# EAGLE design Data Cable REPLACMENT (EAGLE 9.6.2)
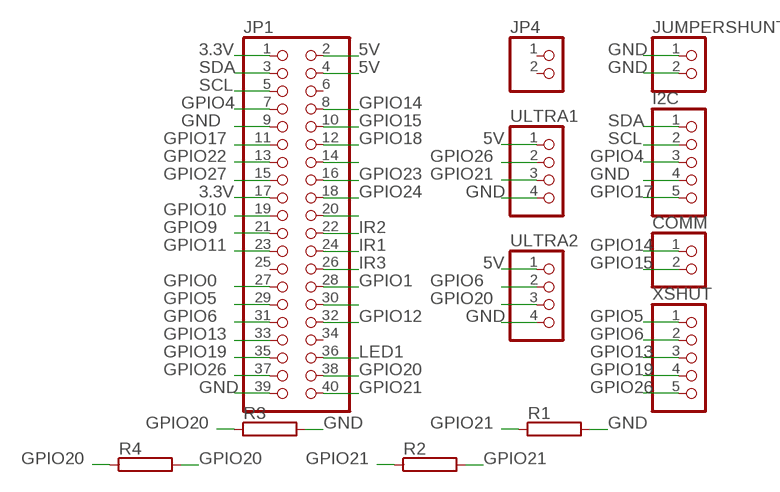
[diagram p0: schematic, sheet 1]

## Parts
COMM  PINHD-1X2  [1X02]
I2C  PINHD-1X5  [1X05]
JP1  PINHD-2X20  [2X20]
JP4  PINHD-1X2  [1X02]
JUMPERSHUNT  PINHD-1X2  [1X02]
R1  RHPS58  [HPS58]
R2  RHPS58  [HPS58]
R3  RHPS58  [HPS58]
R4  RHPS58  [HPS58]
ULTRA1  PINHD-1X4  [1X04]
ULTRA2  PINHD-1X4  [1X04]
XSHUT  PINHD-1X5  [1X05]

## Nets
3.3V: JP1.1 JP1.17
5V: JP1.2 JP1.4 ULTRA1.1 ULTRA2.1
GND: I2C.4 JP1.9 JP1.39 JUMPERSHUNT.1 JUMPERSHUNT.2 R1.2 R3.2 ULTRA1.4 ULTRA2.4
GPIO0: JP1.27
GPIO1: JP1.28
GPIO4: I2C.3 JP1.7
GPIO5: JP1.29 XSHUT.1
GPIO6: JP1.31 ULTRA2.2 XSHUT.2
GPIO9: JP1.21
GPIO10: JP1.19
GPIO11: JP1.23
GPIO12: JP1.32
GPIO13: JP1.33 XSHUT.3
GPIO14: COMM.1 JP1.8
GPIO15: COMM.2 JP1.10
GPIO17: I2C.5 JP1.11
GPIO18: JP1.12
GPIO19: JP1.35 XSHUT.4
GPIO20: JP1.38 R3.1 R4.1 R4.2 ULTRA2.3
GPIO21: JP1.40 R1.1 R2.1 R2.2 ULTRA1.3
GPIO22: JP1.13
GPIO23: JP1.16
GPIO24: JP1.18
GPIO26: JP1.37 ULTRA1.2 XSHUT.5
GPIO27: JP1.15
IR1: JP1.24
IR2: JP1.22
IR3: JP1.26
LED1: JP1.36
N$23: JP1.30
N$28: JP1.20
N$31: JP1.14
SCL: I2C.2 JP1.5
SDA: I2C.1 JP1.3
Unconnected: JP1.6 JP1.25 JP1.34 JP4.1 JP4.2

## Library data of the parts
COMM JP4 JUMPERSHUNT = pinhead:PINHD-1X2: PIN HEADER
I2C XSHUT = pinhead:PINHD-1X5: PIN HEADER
JP1 = pinhead by eyad and omar:PINHD-2X20: PIN HEADER
R1-R4 = resistor-power:R: Power Resitor; OC_FARNELL: unknown; OC_NEWARK: unknown
ULTRA1 ULTRA2 = pinhead:PINHD-1X4: PIN HEADER

## Board
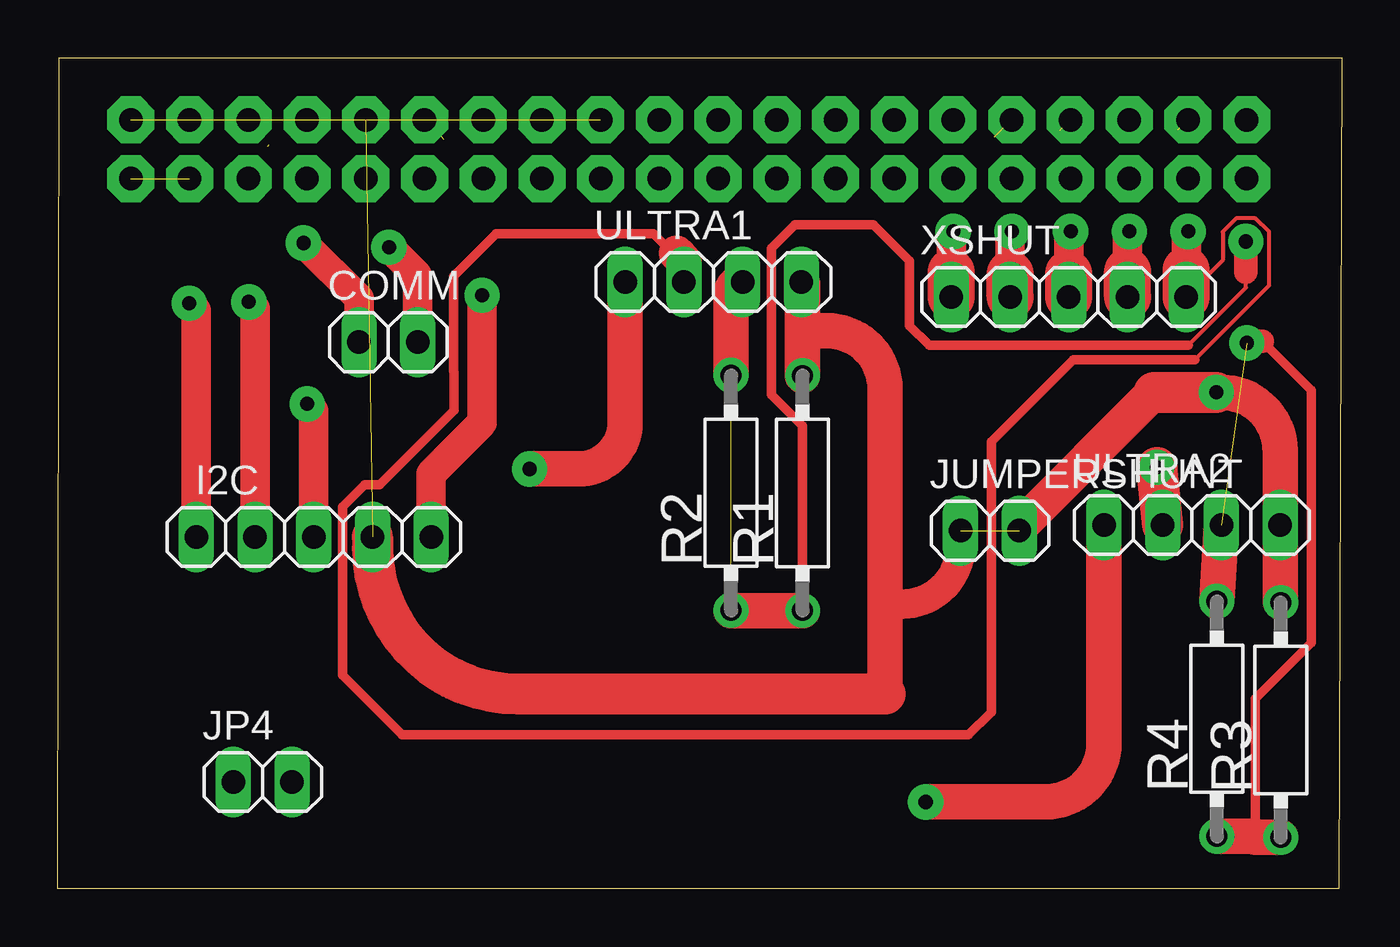
[diagram p1: board, top side]
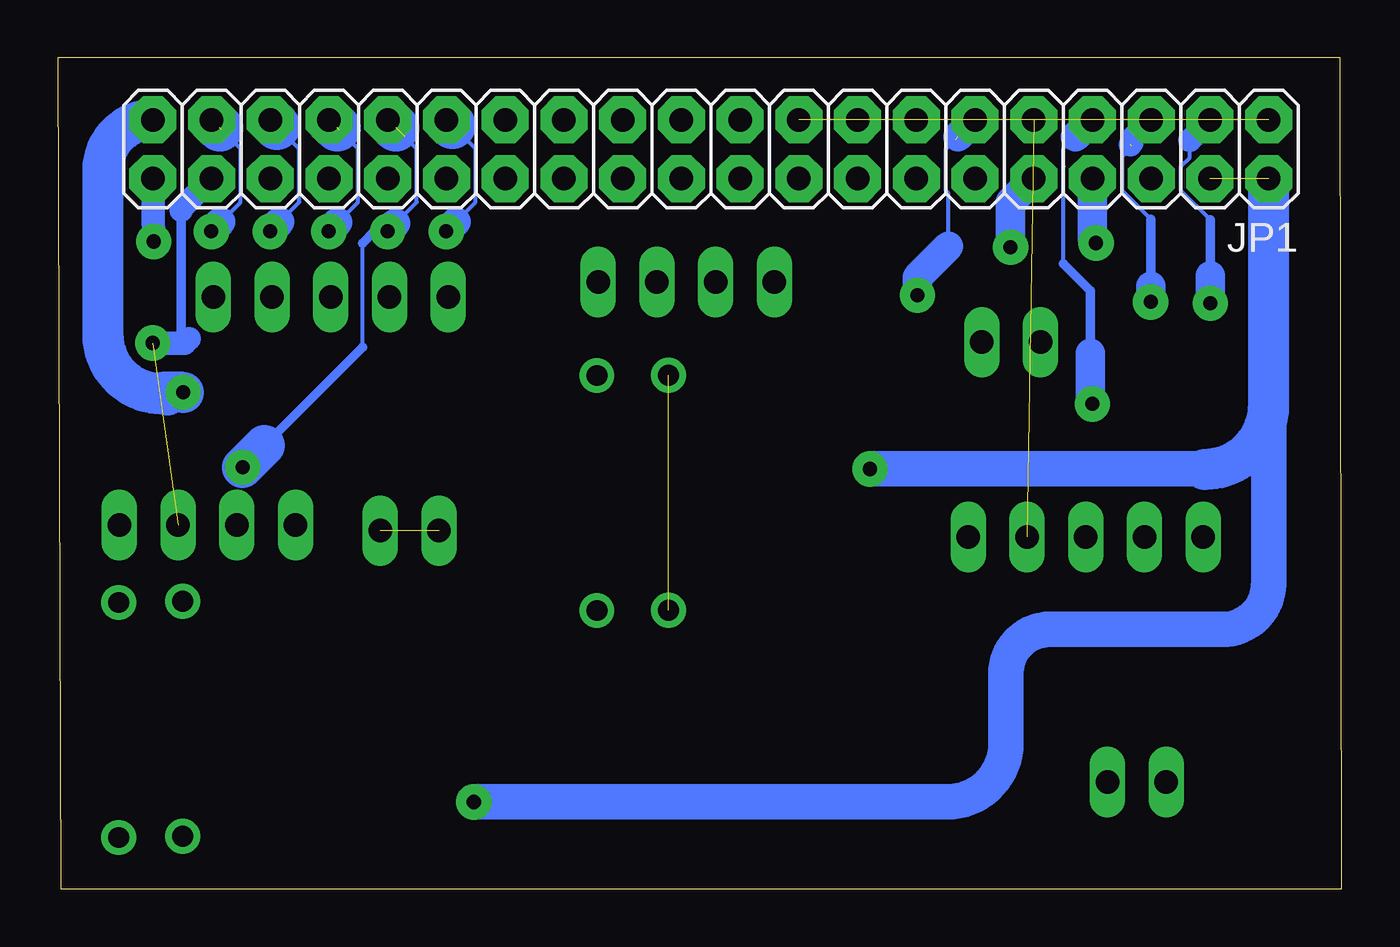
[diagram p2: board, bottom side, seen from below]

Size 55.53 x 35.92 mm. Coordinates in mm from the lower left corner, seen from the top.
Outline: 55.4,0 0,0.01 0.07,35.92 55.53,35.92 55.4,0
Copper layers (1*16): Top 0.035mm / dielectric 1.5mm / Bottom 0.035mm
Design rules "default *": minimum track width 6mil, minimum drill 0.35mm, track to track 6mil, track to pad 6mil, pad to pad 6mil, via to via 6mil, smd to smd 6mil, copper to edge 40mil, drill to drill 6mil, minimum pad ring 10mil, minimum via ring 8mil, stop-mask expansion 4mil, vias tented up to drill 0mil, thermal gap 10mil

### Footprints (pad centres in the part's own frame; a part is rotated, then mirrored left to right if it is on the bottom)
1X02 = drill 1.016 long: 1 -1.27,0; 2 1.27,0
1X05 = drill 1.016 long: 1 -5.08,0; 2 -2.54,0; 3 0,0; 4 2.54,0; 5 5.08,0
2X20 = drill 1.016 pad 2.032 octagon: 1 -24.13,-1.27; 2 -24.13,1.27; 3 -21.59,-1.27; 4 -21.59,1.27; 5 -19.05,-1.27; 6 -19.05,1.27; 7 -16.51,-1.27; 8 -16.51,1.27; 9 -13.97,-1.27; 10 -13.97,1.27; 11 -11.43,-1.27; 12 -11.43,1.27; 13 -8.89,-1.27; 14 -8.89,1.27; 15 -6.35,-1.27; 16 -6.35,1.27; 17 -3.81,-1.27; 18 -3.81,1.27; 19 -1.27,-1.27; 20 -1.27,1.27; 21 1.27,-1.27; 22 1.27,1.27; 23 3.81,-1.27; 24 3.81,1.27; 25 6.35,-1.27; 26 6.35,1.27; 27 8.89,-1.27; 28 8.89,1.27; 29 11.43,-1.27; 30 11.43,1.27; 31 13.97,-1.27; 32 13.97,1.27; 33 16.51,-1.27; 34 16.51,1.27; 35 19.05,-1.27; 36 19.05,1.27; 37 21.59,-1.27; 38 21.59,1.27; 39 24.13,-1.27; 40 24.13,1.27
HPS58 = drill 0.9 pad 1.5: 1 -5.08,0; 2 5.08,0
1X04 = drill 1.016 long: 1 -3.81,0; 2 -1.27,0; 3 1.27,0; 4 3.81,0

### Placement (x,y rotation side)
COMM  14.29,23.63 0 top
I2C  11.07,15.2 0 top
JP1  27.29,31.97 180 bottom
JP4  8.86,4.61 0 top
JUMPERSHUNT  40.31,15.48 0 top
R1  32.21,17.1 90 top
R2  29.12,17.11 90 top
R3  52.89,7.29 90 top
R4  50.13,7.34 90 top
ULTRA1  28.35,26.23 0 top
ULTRA2  49.06,15.72 0 top
XSHUT  43.72,25.58 0 top

### Tracks (layer width: path | path; a pad name or v marks a point on that pad's centre or on a via)
3.3V  (1 unrouted)
5V  (via drill 0.61 pad 1.52)  (1 unrouted)
  Top 1.524: ULTRA1.1 24.54,20.16 arc-90 22.52,18.15 v20.4,18.15 | ULTRA2.1 45.25,6.29 arc-90 42.71,3.75 v37.54,3.75
  Bottom 1.524: 5.94,18.13 5.95,18.15 v20.4,18.15 | v37.54,3.75 17.06,3.75 arc-90 14.52,6.29 14.52,9.29 arc90 12.6,11.21 5.14,11.21 arc-90 3.16,13.2 3.16,20.91
  Bottom 1.778: 5.94,18.13 arc-90 3.16,20.91 JP1.2
GND  (via drill 0.61 pad 1.52)  (2 unrouted)
  Top 1.27: JUMPERSHUNT.1 39.04,14.84 arc-90 36.5,12.3 35.78,12.3
  Top 1.524: R1.2 32.21,24.13 | 32.21,24.13 32.21,26.18 ULTRA1.4 | 32.21,24.13 33.24,24.13 arc-90 35.78,21.59 35.78,12.3 35.78,8.42 | R3.2 52.87,12.4 ULTRA2.4 52.87,18.92 arc90 50.33,21.46 v50.1,21.46 | JUMPERSHUNT.2 41.58,15.64 47.41,21.46
  Top 1.778: I2C.4 13.61,14.72 arc90 19.91,8.42 35.78,8.42 | 47.41,21.46 v50.1,21.46
  Bottom 1.778: 50.79,21.35 arc90 50.74,21.4 51.04,21.4 | JP1.39 arc-90 53.58,31.08 53.58,23.94 arc-90 51.04,21.4 | v50.1,21.46 50.98,21.46 arc-90 51.04,21.4
GPIO4  (via drill 0.61 pad 1.52)
  Top 1.27: v10.78,20.96 11.07,20.66 I2C.3
  Bottom 0.178: 12.03,27.02 12.03,31.22 12.03,31.23 12.03,32.01 11.54,32.51 11.51,32.51
  Bottom 0.4: 10.86,23.14 10.86,25.85 12.03,27.02
  Bottom 1.27: 10.86,23.14 10.86,21.04 arc90 v10.78,20.96 | 11.51,32.51 JP1.7
GPIO5  (via drill 0.61 pad 1.52)
  Top 1.27: 38.64,26.66 38.64,28.33 v38.73,28.42
  Top 2.032: XSHUT.1 38.64,26.66
  Bottom 0.178: 38.3,28.84 37.46,29.68 37.46,31.99 38.46,32.99
  Bottom 1.27: v38.73,28.42 38.3,28.84
  Bottom 2.032: JP1.29 38.46,32.99
GPIO6  (via drill 0.61 pad 1.52)  (1 unrouted)
  Top 0.178: 41.27,28.4 v41.27,28.42
  Top 1.27: 41.18,26.57 41.18,28.31 41.27,28.4
  Top 1.778: ULTRA2.2 v47.53,18.22
  Top 2.032: XSHUT.2 41.18,26.57
  Bottom 0.178: 40.92,28.76 40,29.68 40,31.99 40.52,32.5 | 42.35,23.4 42.35,27.91 | 41.85,28.42 v41.27,28.42
  Bottom 0.4: 46.59,19.16 42.35,23.4 | 42.35,27.91 41.85,28.42
  Bottom 1.27: v41.27,28.42 40.92,28.76
  Bottom 1.778: v47.53,18.22 46.59,19.16
  Bottom 2.032: JP1.31 40.9,32.89
GPIO13  (via drill 0.61 pad 1.52)  (1 unrouted)
  Top 1.27: 43.72,26.59 43.72,28.33 v43.81,28.42
  Top 2.032: XSHUT.3 43.72,26.59
  Bottom 0.178: 43.42,28.81 42.54,29.68 42.54,31.99 43.34,32.79
  Bottom 1.27: v43.81,28.42 43.42,28.81
  Bottom 2.032: JP1.33 43.44,32.89
GPIO14  (via drill 0.61 pad 1.52)
  Top 1.27: v10.62,27.91 13.02,25.52 COMM.1
  Bottom 1.27: JP1.8 10.78,28.07 v10.62,27.91
GPIO15  (via drill 0.61 pad 1.52)
  Top 1.27: v14.32,27.73 15.56,26.49 COMM.2
  Bottom 1.27: v14.32,27.73 14.32,29.69 14.05,29.96 14.05,29.97 JP1.10
GPIO17  (via drill 0.61 pad 1.52)  (1 unrouted)
  Top 1.27: v18.35,25.66 18.35,20.14 16.15,17.94 I2C.5
  Bottom 0.178: 17.02,27.77 17.02,30.08 17.11,30.18 17.11,31.99 16.71,32.39
  Bottom 1.27: v18.35,25.66 18.35,26.43 17.02,27.77 | JP1.11 16.59,32.51
GPIO19  (via drill 0.61 pad 1.52)
  Top 0.178: 46.35,28.4 v46.35,28.42
  Top 1.27: 46.26,26.69 46.26,28.31 46.35,28.4
  Top 2.032: XSHUT.4 46.26,26.69
  Bottom 0.178: 45.94,28.83 45.08,29.68 45.08,31.99 46.05,32.95
  Bottom 1.27: v46.35,28.42 45.94,28.83
  Bottom 2.032: JP1.35 46.05,32.95
GPIO20  (via drill 0.61 pad 1.52)  (1 unrouted)
  Top 0.178: 51.8,2.22 51.8,2.26
  Top 0.4: 51.8,2.26 51.8,8.21 54.22,10.62 54.22,21.55 52.09,23.67
  Top 1.016: 52.09,23.67 51.51,23.67 v51.43,23.59
  Top 1.524: ULTRA2.3 R4.2 | R4.1 51.8,2.26 | 51.8,2.22 R3.1
  Bottom 0.178: 49.78,23.71 49.85,23.78 50.19,24.12
  Bottom 0.4: 50.19,24.12 50.19,29.33
  Bottom 1.016: 50.19,29.33 50.19,29.39 JP1.38 | v51.43,23.59 50.04,23.59 49.85,23.78
GPIO21  (via drill 0.61 pad 1.52)  (1 unrouted)
  Top 0.178: 48.88,23.49 51.38,25.99 51.38,26.65
  Top 0.4: R1.1 32.21,20.01 30.87,21.36 30.87,27.7 31.88,28.71 35.27,28.71 36.84,27.14 36.84,24.34 37.69,23.49 48.88,23.49
  Top 1.016: 51.38,26.65 v51.38,27.98
  Top 1.524: R1.1 R2.1 arc-90 R2.1 | R2.2 29.12,25.72 arc-90 ULTRA1.3
  Bottom 1.016: v51.38,27.98 JP1.40
GPIO26  (via drill 0.61 pad 1.52)  (1 unrouted)
  Top 0.178: 48.85,28.38 v48.89,28.42 | 26.75,27.47 26.75,27.33 | 17.11,22.37 17.14,22.33 | 49.17,22.87 52.39,26.08 52.39,28.39 51.8,28.98 50.97,28.98 50.38,28.39 50.38,27.17 XSHUT.5
  Top 0.4: 26.75,27.33 25.76,28.32 18.96,28.32 17.11,26.47 17.11,22.37 | 17.14,22.33 17.14,20.69 13.91,17.47 13.26,17.47 12.32,16.52 12.32,9.22 14.89,6.65 39.39,6.65 40.37,7.63 40.37,19.32 43.91,22.87 49.17,22.87
  Top 1.27: 48.8,26.75 48.8,28.33 48.85,28.38
  Top 1.524: ULTRA1.2 27.08,27.13 26.75,27.47
  Top 2.032: XSHUT.5 48.8,26.75
  Bottom 0.178: 48.48,28.83 47.62,29.68 47.62,31.99 48.44,32.81
  Bottom 1.27: v48.89,28.42 48.48,28.83
  Bottom 2.032: JP1.37 48.52,32.89
SCL  (via drill 0.61 pad 1.52)  (1 unrouted)
  Top 1.27: v8.26,25.37 8.53,25.1 I2C.2
  Bottom 0.178: 8.26,28.95 9.49,30.18 9.49,31.67 9.07,32.1
  Bottom 0.4: 8.26,26.05 8.26,28.95
  Bottom 1.016: JP1.5 9.07,32.41 9.07,32.24 9.14,32.17
  Bottom 1.27: v8.26,25.37 8.26,26.05
SDA  (via drill 0.61 pad 1.52)
  Top 1.27: I2C.1 5.99,25 v5.68,25.31
  Bottom 0.178: 6.57,32.37 6.57,31.61 6.95,31.22 6.95,30.18 5.68,28.91
  Bottom 0.4: 5.68,26.51 5.68,28.91
  Bottom 1.016: JP1.3 6.57,32.37 6.58,32.37
  Bottom 1.27: v5.68,25.31 5.68,26.51